# EAGLE design NodecLCD.v1 (EAGLE 4.16)
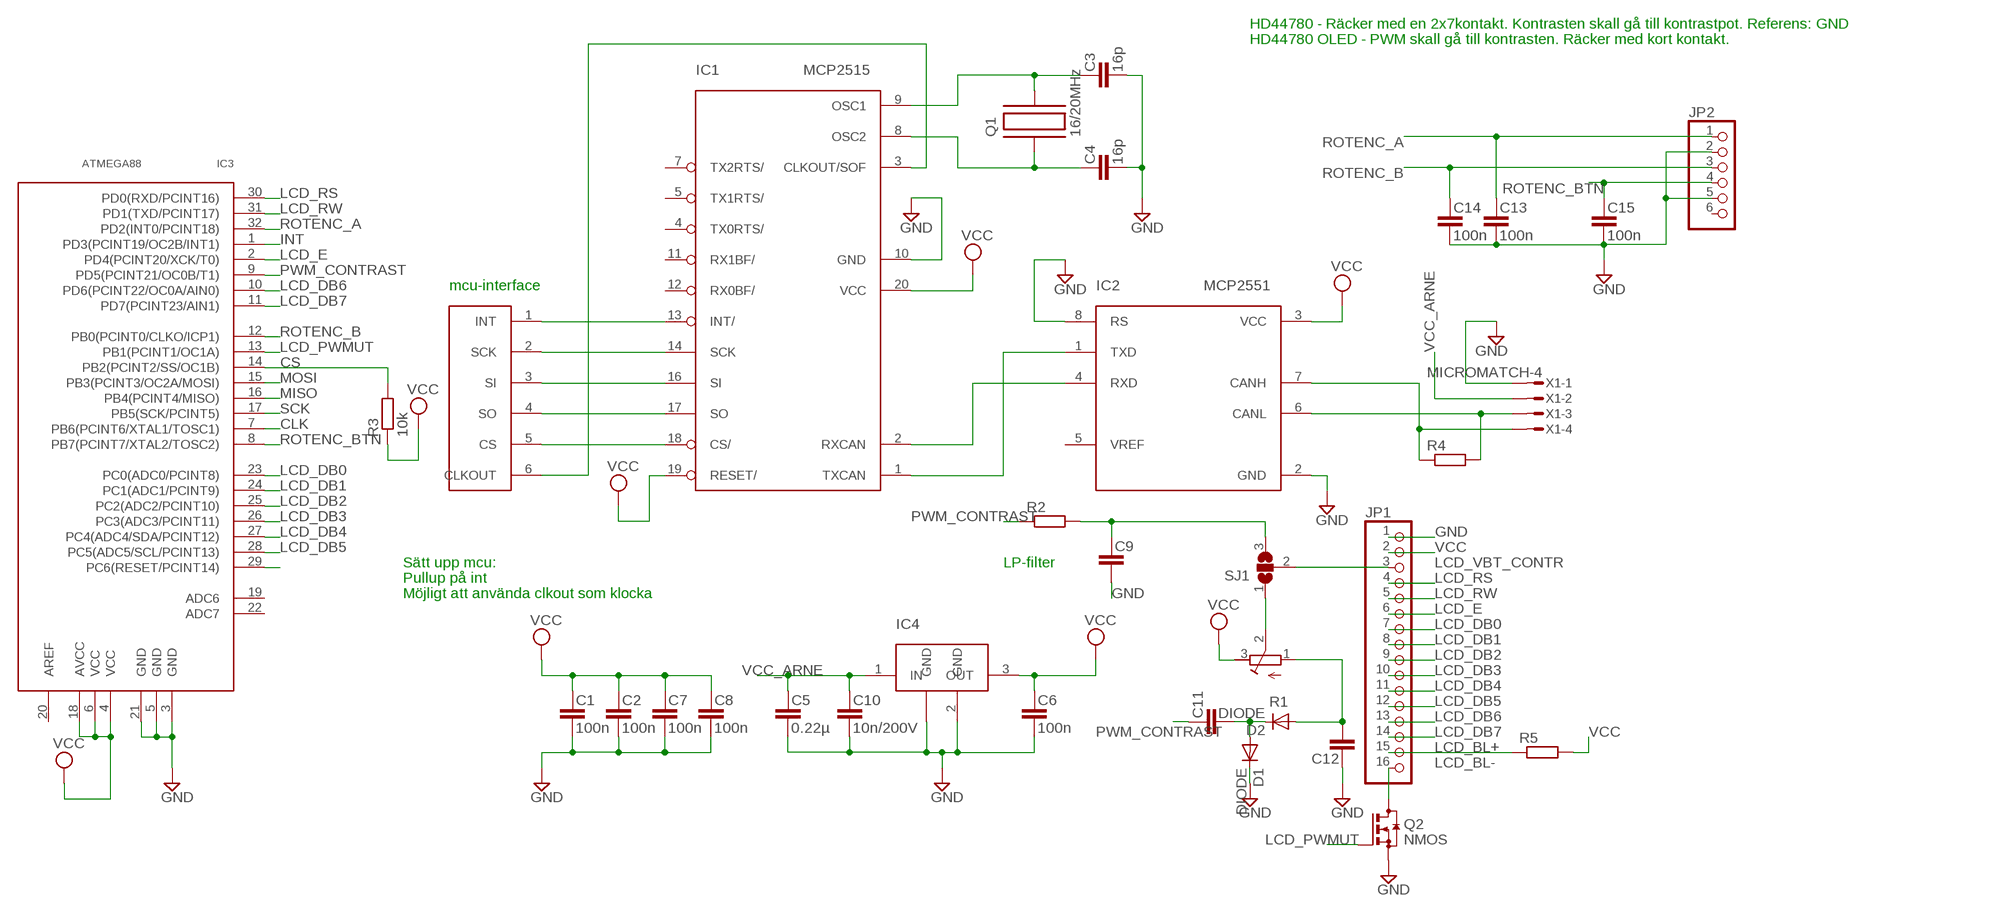
[diagram p0: schematic, sheet 1]

## Parts
C1  100n  C-EU  [C0603]
C2  100n  C-EU  [C0603]
C3  16p  C-EU  [C0603]
C4  16p  C-EU  [C0603]
C5  0.22µ  C-EU  [C0603]
C6  100n  C-EU  [C0603]
C7  100n  C-EU  [C0603]
C8  100n  C-EU  [C0603]
C9  C-EU  [C0603]
C10  10n/200V  C-EU  [C0603]
C11  C-EU  [C0603]
C12  C-EU  [C0603]
C13  100n  C-EU  [C0603]
C14  100n  C-EU  [C0603]
C15  100n  C-EU  [C0603]
D1  DIODE  [SOD323]
D2  DIODE  [SOD323]
IC1  MCP2515  [TSSOP]
IC2  MCP2551  [SOIC]
IC3  ATMEGA88  [TQFP32]
IC4  LM340MP-5.0  [SOT223]
JP1  PINHD-2X08  [2X08]
JP2  PINHD-2X03  [2X03]
Q1  16/20MHz  C-MAC-LFA147E  [SMD]
Q2  NMOS  [SOT23]
R1  R-TRIM  [TRIM_PVZ3]
R2  R-EUR0603  [R0603]
R3  10k  R-EUR0603  [R0603]
R4  R-EUR0603  [R0603]
R5  R-EUR0603  [R0603]
SJ1  SJ_2_NOS  [SJ_2_NO_SMALL]
U$1  CAN-INTERFACE  [VIA-LIST]
X1  MICROMATCH-4  [MICROMATCH-4]

## Nets
CANH: IC2.7(CANH) R4.1 X1.4
CANL: IC2.6(CANL) R4.2 X1.3
CLK: IC1.3(CLKOUT/SOF) IC3.7(PB6(PCINT6/XTAL1/TOSC1)) U$1.6(CLKOUT)
CS: IC1.18(CS/) IC3.14(PB2(PCINT2/SS/OC1B)) R3.2 U$1.5(CS)
GND: C1.2 C2.2 C3.2 C4.2 C5.2 C6.2 C7.2 C8.2 C9.2 C10.2 C12.1 C13.2 C14.2 C15.2 D1.C IC1.10(GND) IC2.2(GND) IC2.8(RS) IC3.3(GND) IC3.5(GND) IC3.21(GND) IC4.2(GND) IC4.4(GND) JP1.1 JP2.2 JP2.5 Q2.2(S) X1.1
INT: IC1.13(INT/) IC3.1(PD3(PCINT19/OC2B/INT1)) U$1.1(INT)
LCD_BL+: JP1.15 R5.1
LCD_BL-: JP1.16 Q2.3(D)
LCD_DB0: IC3.23(PC0(ADC0/PCINT8)) JP1.7
LCD_DB1: IC3.24(PC1(ADC1/PCINT9)) JP1.8
LCD_DB2: IC3.25(PC2(ADC2/PCINT10)) JP1.9
LCD_DB3: IC3.26(PC3(ADC3/PCINT11)) JP1.10
LCD_DB4: IC3.27(PC4(ADC4/SDA/PCINT12)) JP1.11
LCD_DB5: IC3.28(PC5(ADC5/SCL/PCINT13)) JP1.12
LCD_DB6: IC3.10(PD6(PCINT22/OC0A/AIN0)) JP1.13
LCD_DB7: IC3.11(PD7(PCINT23/AIN1)) JP1.14
LCD_E: IC3.2(PD4(PCINT20/XCK/T0)) JP1.6
LCD_PWMUT: IC3.13(PB1(PCINT1/OC1A)) Q2.1(G)
LCD_RS: IC3.30(PD0(RXD/PCINT16)) JP1.4
LCD_RW: IC3.31(PD1(TXD/PCINT17)) JP1.5
LCD_VBT_CONTR: JP1.3 SJ1.2
MISO: IC1.17(SO) IC3.16(PB4(PCINT4/MISO)) U$1.4(SO)
MOSI: IC1.16(SI) IC3.15(PB3(PCINT3/OC2A/MOSI)) U$1.3(SI)
N$1: IC1.2(RXCAN) IC2.4(RXD)
N$2: IC1.1(TXCAN) IC2.1(TXD)
N$3: R1.2(PAD2) SJ1.1
N$4: C11.2 D1.A D2.C
N$5: C12.2 D2.A R1.1(PAD1)
N$6: C9.1 R2.2 SJ1.3
N$12: C3.1 IC1.9(OSC1) Q1.P$2
N$13: C4.1 IC1.8(OSC2) Q1.P$1
PWM_CONTRAST: C11.1 IC3.9(PD5(PCINT21/OC0B/T1)) R2.1
RESET: IC3.29(PC6(RESET/PCINT14))
ROTENC_A: C13.1 IC3.32(PD2(INT0/PCINT18)) JP2.1
ROTENC_B: C14.1 IC3.12(PB0(PCINT0/CLKO/ICP1)) JP2.3
ROTENC_BTN: C15.1 IC3.8(PB7(PCINT7/XTAL2/TOSC2)) JP2.4
SCK: IC1.14(SCK) IC3.17(PB5(SCK/PCINT5)) U$1.2(SCK)
VCC: C1.1 C2.1 C6.1 C7.1 C8.1 IC1.19(RESET/) IC1.20(VCC) IC2.3(VCC) IC3.4(VCC) IC3.6(VCC) IC3.18(AVCC) IC4.3(OUT) JP1.2 R1.3(PAD3) R3.1 R5.2
VCC_ARNE: C5.1 C10.1 IC4.1(IN) X1.2
Unconnected: IC1.4(TX0RTS/) IC1.5(TX1RTS/) IC1.7(TX2RTS/) IC1.11(RX1BF/) IC1.12(RX0BF/) IC2.5(VREF) IC3.19(ADC6) IC3.20(AREF) IC3.22(ADC7) JP2.6

## Notes on the sheet
- HD44780 - Räcker med en 2x7kontakt. Kontrasten skall gå till kontrastpot. Referens: GND
- HD44780 OLED - PWM skall gå till kontrasten. Räcker med kort kontakt.
- mcu-interface
- Sätt upp mcu: | LP-filter
- Pullup på int
- Möjligt att använda clkout som klocka

## Library data of the parts
C1-C15 = rcl:C-EU
D1 D2 = diode:DIODE: DIODE ultra fast rectifier, 3 A
IC1 = mcp2515:MCP2515
IC2 = mcp2551:MCP2551
IC3 = atmega88:ATMEGA88
IC4 = lm340mp:LM340MP-5.0
JP1 = pinhead-mm:PINHD-2X08
JP2 = pinhead-mm:PINHD-2X03
Q1 = hc49-4h-smx:C-MAC-LFA147E
Q2 = transistor:NMOS
R1 = rcl:R-TRIM
R2-R5 = rcl:R-EU
SJ1 = jumper:SJ_2_NO
U$1 = can-interface:CAN-INTERFACE
X1 = con-amp-micromatch:MICROMATCH-4: MicroMaTch 4 7-215464-4 / 0-215464-4 Drawing Number C-215464 DDEController.pdf

## Board
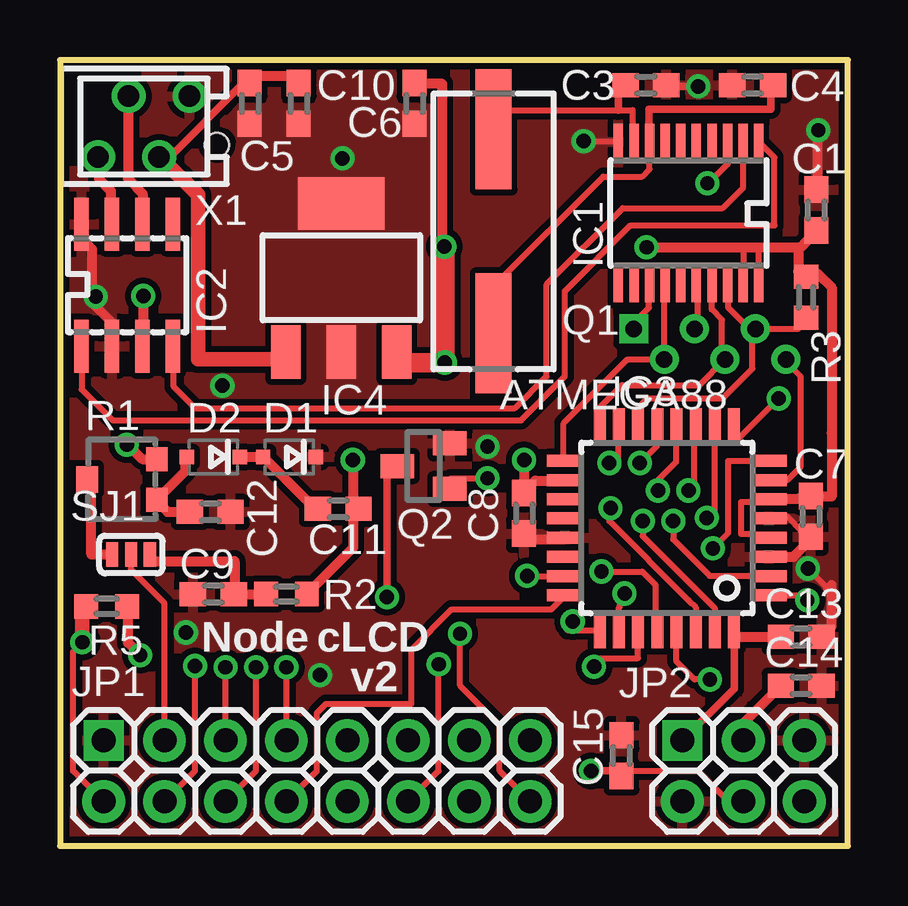
[diagram p1: board, top side]
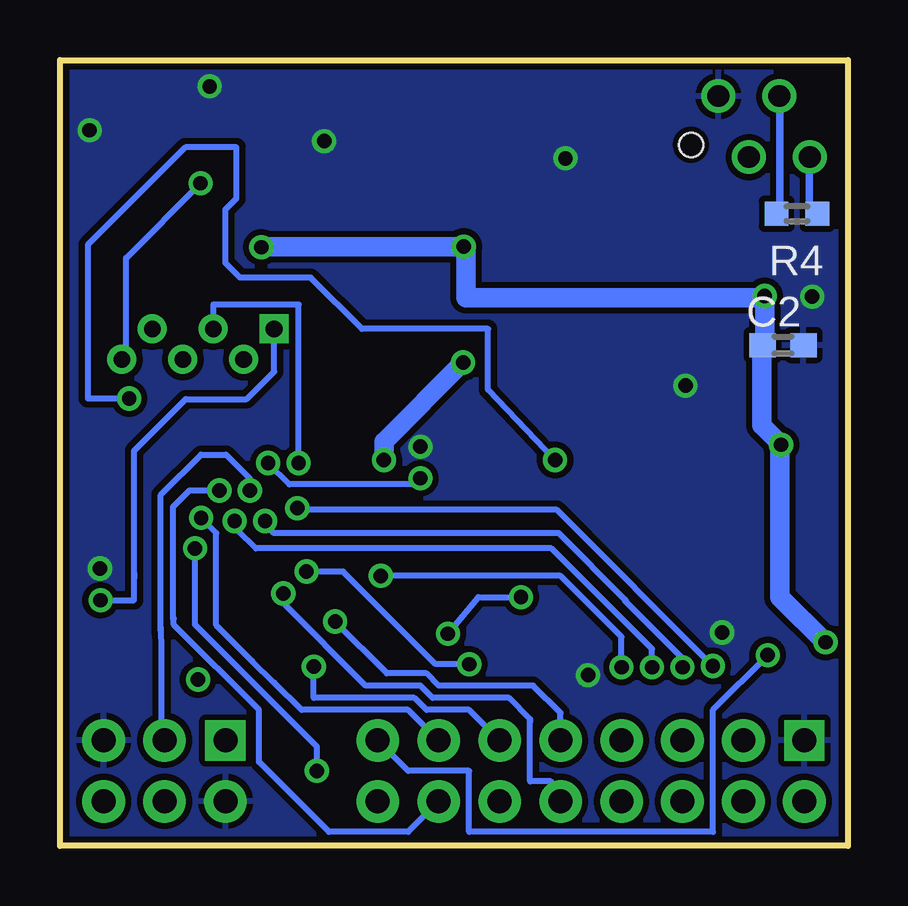
[diagram p2: board, bottom side, seen from below]

Size 32.85 x 32.75 mm. Coordinates in mm from the lower left corner, seen from the top.
Outline: 0,0 32.85,0 32.85,32.75 0,32.75 0,0
Copper layers (1*16): Top 0.035mm / dielectric 1.5mm / Bottom 0.035mm
Design rules "10mils, 0.6drill": minimum track width 10mil, minimum drill 0.6mm, track to track 10mil, track to pad 10mil, pad to pad 10mil, via to via 10mil, smd to smd 10mil, copper to edge 10mil, drill to drill 10mil, minimum pad ring 10mil, minimum via ring 8mil, stop-mask expansion 0mil, vias tented up to drill 0mil, thermal gap 10mil

### Footprints (pad centres in the part's own frame; a part is rotated, then mirrored left to right if it is on the bottom)
C0603 = smd 1.1 x 1: 1 -0.85,0; 2 0.85,0
SOD323 = smd 0.6 x 0.6: A 1.1,0; C -1.1,0
TSSOP = smd 0.396 x 1.5: 1 -2.925,-2.975; 2 -2.275,-2.975; 3 -1.625,-2.975; 4 -0.975,-2.975; 5 -0.325,-2.975; 6 0.325,-2.975; 7 0.975,-2.975; 8 1.625,-2.975; 9 2.275,-2.975; 10 2.925,-2.975; 11 2.925,2.975; 12 2.275,2.975; 13 1.625,2.975; 14 0.975,2.975; 15 0.325,2.975; 16 -0.325,2.975; 17 -0.975,2.975; 18 -1.625,2.975; 19 -2.275,2.975; 20 -2.925,2.975
SOIC = smd 0.6 x 2.2: 1 -1.905,-2.54; 2 -0.635,-2.54; 3 0.635,-2.54; 4 1.905,-2.54; 5 1.905,2.54; 6 0.635,2.54; 7 -0.635,2.54; 8 -1.905,2.54
TQFP32 = smd 1.5 x 0.5: 1 -4.25,2.65; 2 -4.25,1.85; 3 -4.25,1.05; 4 -4.25,0.25; 5 -4.25,-0.55; 6 -4.25,-1.35; 7 -4.25,-2.15; 8 -4.25,-2.95; 17 4.25,-2.95; 18 4.25,-2.15; 19 4.25,-1.35; 20 4.25,-0.55; 21 4.25,0.25; 22 4.25,1.05; 23 4.25,1.85; 24 4.25,2.65 | smd 0.5 x 1.5: 9 -2.8,-4.4; 10 -2,-4.4; 11 -1.2,-4.4; 12 -0.4,-4.4; 13 0.4,-4.4; 14 1.2,-4.4; 15 2,-4.4; 16 2.8,-4.4; 25 2.8,4.1; 26 2,4.1; 27 1.2,4.1; 28 0.4,4.1; 29 -0.4,4.1; 30 -1.2,4.1; 31 -2,4.1; 32 -2.8,4.1
SOT223 = smd 1.219 x 2.235: 1 -2.311,-3.099; 2 0,-3.099; 3 2.311,-3.099 | smd 3.6 x 2.2: 4 0,3.099
2X08 = drill 1 pad 1.676 square: 1 -8.89,1.27 | drill 1 pad 1.778 round: 2 -8.89,-1.27; 3 -6.35,1.27; 4 -6.35,-1.27; 5 -3.81,1.27; 6 -3.81,-1.27; 7 -1.27,1.27; 8 -1.27,-1.27; 9 1.27,1.27; 10 1.27,-1.27; 11 3.81,1.27; 12 3.81,-1.27; 13 6.35,1.27; 14 6.35,-1.27; 15 8.89,1.27; 16 8.89,-1.27
2X03 = drill 1 pad 1.676 square: 1 -2.54,1.27 | drill 1 pad 1.778 round: 2 -2.54,-1.27; 3 0,1.27; 4 0,-1.27; 5 2.54,1.27; 6 2.54,-1.27
SMD = smd 5 x 1.5: P$1 4.25,0; P$2 -4.25,0
SOT23 = smd 1 x 1.4: 1 -0.95,-1.1; 2 0.95,-1.1; 3 0,1.1
TRIM_PVZ3 = smd 1 x 0.9: 1 0.5,0.45; 3 2.2,0.45 | smd 1.1 x 0.9: 2 1.35,3.35
R0603 = smd 0.991 x 1.016: 1 -0.85,0; 2 0.85,0
SJ_2_NO_SMALL = smd 0.508 x 1.016: 1 -0.787,0; 2 0,0; 3 0.787,0
VIA-LIST = drill 0.7 square: 1 0,2.54 | drill 0.7 round: 2 -1.27,1.27; 3 0,0; 4 -1.27,-1.27; 5 0,-2.54; 6 -1.27,-3.81
MICROMATCH-4 = drill 0.9 round: 1 1.905,1.27; 2 0.635,-1.27; 3 -0.635,1.27; 4 -1.905,-1.27 | hole 1: 3.048,-0.762

### Placement (x,y rotation side)
C1  31.54,26.49 90 top
C2  2.7,20.86 0 bottom
C3  24.43,31.7 0 top
C4  28.87,31.7 180 top
C5  7.92,30.94 270 top
C6  14.77,30.94 270 top
C7  31.3,13.73 270 top
C8  19.34,13.86 270 top
C9  6.39,10.49 180 top
C10  9.95,30.94 270 top
C11  11.6,14.05 180 top
C12  6.26,13.92 180 top
C13  30.9,8.71 0 top
C14  30.9,6.68 0 top
C15  23.41,3.76 90 top
D1  9.57,16.21 180 top
D2  6.39,16.21 180 top
IC1  26.21,26.37 180 top
IC2  2.8,23.36 0 top
IC3  25.3,13.09 180 top
IC4  11.73,23.67 0 top
JP1  10.71,3.12 0 top
JP2  28.49,3.12 0 top
Q1  18.08,25.6 270 top
Q2  15.15,15.82 90 top
R1  4.49,13.92 90 top
R2  9.44,10.49 180 top
R3  31.11,22.86 270 top
R4  2.12,26.34 180 bottom
R5  1.95,9.98 180 top
SJ1  2.96,12.14 0 top
U$1  26.46,21.54 90 top
X1  3.5,29.97 0 top

### Tracks (layer width: path | path; a pad name or v marks a point on that pad's centre or on a via)
CANH
  Top 0.305: 2.12,25.95 IC2.7 | X1.4 1.62,28.7
  Top 0.406: 2.12,25.95 2.12,27.28 1.62,27.79 1.62,28.7
  Bottom 0.305: X1.4 1.62,28.7 1.62,26.68 R4.1
CANL
  Top 0.305: IC2.6 | X1.3 2.84,31.24
  Top 0.406: IC2.6 3.45,27.18 2.84,27.79 2.84,31.24
  Bottom 0.305: X1.3 2.84,31.24 2.84,26.48 R4.2
CLK  (via drill 0.6)
  Top 0.254: IC1.3 27.83,29.24 27.83,28.4 27.02,27.59 v26.99,27.61 | IC3.7 30.32,15.24 30.88,15.8 30.88,19.56 30.22,20.22 30.17,20.27
  Top 0.406: 30.17,20.17 30.22,20.22 U$1.6
  Bottom 0.254: v26.99,27.61 30.09,24.49 30.09,20.42 U$1.6
CS
  Top 0.254: IC1.18 27.83,23.52 27.86,23.52 27.86,22.43 28.87,21.41 | IC3.14 24.07,17.63 | 24.07,17.63 24.07,17.64 | 28.87,21.41 28.87,19.89 27.63,18.64 24.48,18.64 24.07,18.24 24.07,17.83 24.17,17.12 24.07,17.63 | 28.87,21.41 U$1.5 30.78,21.54 31.03,21.79 31.03,22 30.97,22 R3.2
GND  (via drill 0.6)
  Top 0.254: v21.84,29.36 23.28,29.36 IC1.10 | C1.2 31.59,27.66 | 1.34,22.63 v1.49,22.89 | C7.2 31.11,13.08 30.93,13.08 30.32,13.72 29.76,13.67 29.74,13.64 IC3.5 | v31.61,29.82 31.44,29.77 31.59,29.62 | Q2.2 16.63,16.79 | v31.18,11.56 32.02,10.72 32.3,10.44
  Top 0.305: IC2.2 2.2,21.16 | C3.2 25.45,31.65 v26.61,31.65 | 30.93,13.08 31.16,13.08 31.18,13.06 31.18,12.55
  Top 0.406: 2.2,21.16 2.2,21.77 1.34,22.63 1.34,24.87 0.83,25.38 IC2.8 | 31.59,27.66 31.59,29.62 | 31.18,12.55 31.08,12.55 30.58,12.04 IC3.3 | IC3.21 21,12.79 21,12.78 19.7,12.78 C8.2 | 32.02,10.72 32.17,10.87 32.17,9.13 C13.2
  Bottom 0.305: v26.61,31.65 26.56,31.73
  other vias: 11.78,28.65 17.82,16.64 6.77,19.18 10.84,7.11 5.25,8.89
  pour Bottom (isolate 0.254): 0.12,32.64 32.83,32.64 32.83,0.23 24.38,0.22 0.12,0.22
  pour Top (isolate 0.305, no thermals): 5.83,32.27 15.89,32.27 15.89,18.56 5.83,18.56
  pour Top (isolate 0.254): 0.17,32.59 32.68,32.59 32.68,0.2 0.17,0.2
INT  (via drill 0.6)
  Top 0.254: IC1.13 | IC1.13 | U$1.1 23.92,21.79 24.55,22.43 24.55,23.37 IC1.13 | IC3.1 31.16,10.44 v31.16,10.24
  Bottom 0.254: 29.76,11.38 29.76,16.46 27.6,18.62 25.06,18.62 23.92,19.76 U$1.1 | 29.76,11.38 29.76,11.13 | v31.16,10.24 29.76,10.24 29.76,11.38
LCD_BL+  (via drill 0.6)
  Top 0.254: 2.84,9.98 3.09,9.98
  Top 0.406: R5.1 2.84,9.98 2.84,8.46 v3.34,7.95
  Bottom 0.254: JP1.15 18.33,3.12 15.79,3.12 15.79,0.59 5.63,0.59 5.63,5.66 v3.34,7.95
LCD_BL-  (via drill 0.6)
  Top 0.254: JP1.16 18.33,3.12 18.33,5.03 16.68,6.68 v16.68,8.84
  Top 0.305: Q2.3 13.63,15.82 v13.63,10.36
  Bottom 0.254: v16.68,8.84 15.41,10.36 v13.63,10.36
  Bottom 0.305: v13.63,10.36 13.63,10.49
LCD_DB0  (via drill 0.6)
  Top 0.254: JP1.7 v9.44,7.44 | IC3.23 19.48,11.24 v19.47,11.25
  Bottom 0.254: v9.44,7.44 9.44,8.71 11.98,11.25 v19.47,11.25
LCD_DB1
  Top 0.254: 20.49,9.86 21,10.39 IC3.24 21.05,10.42 20.49,9.86 | 20.49,9.86 16.32,9.86 14.65,8.18 14.65,5.92 11.09,5.92 10.71,5.54 10.71,3.12 JP1.8
LCD_DB2  (via drill 0.6)
  Top 0.254: IC3.25 21.15,8.99 v21.38,9.35
  Bottom 0.254: v21.38,9.35 19.22,7.19 17.57,7.19 17.06,6.68 13.12,6.68 11.98,5.54 JP1.9
LCD_DB3  (via drill 0.6)
  Top 0.254: IC3.26 23.28,9.01 23.28,9.88 v23.54,10.52
  Bottom 0.254: 13.25,5.16 13.25,2.69 12.39,2.69 JP1.10 | 13.25,5.16 13.25,5.23 | v23.54,10.52 23.54,10.11 20.11,6.68 17.82,6.68 17.31,6.17 14.14,6.17 13.25,5.28 13.25,5.16
LCD_DB4  (via drill 0.6)
  Top 0.254: v22.27,7.47 22.27,7.82 24.1,7.82 IC3.27
  Bottom 0.254: v22.27,7.47 22.27,6.17 18.08,6.17 17.57,5.66 15.79,5.66 JP1.11
LCD_DB5  (via drill 0.6)
  Top 0.254: v22.57,11.43 24.27,11.43 24.83,10.87 24.83,9.7 IC3.28 | JP1.12 15.79,3.12 v15.79,7.57
  Bottom 0.254: v15.79,7.57 17.19,7.57 21.05,11.43 v22.57,11.43
LCD_DB6  (via drill 0.6)
  Top 0.254: IC3.10 27.3,14 v26.97,13.67
  Bottom 0.254: v26.97,13.67 26.34,13.02 26.33,13.03 | JP1.13 18.33,5.66 22.77,5.66 23.92,6.81 24.83,7.7 26.33,9.2 26.33,13.03 | 26.33,13.03
LCD_DB7  (via drill 0.6)
  Top 0.254: v26.2,14.81 26.46,14.81 26.46,17.45 IC3.11
  Bottom 0.254: v26.2,14.81 27.45,14.81 28.13,14.12 28.13,9.48 28.11,9.48 28.11,9.22 24.55,5.66 24.55,3.51 21.63,0.59 18.33,0.59 JP1.14
LCD_E  (via drill 0.6)
  Top 0.254: JP1.6 8.17,3.12 v8.17,7.44 | IC3.2 27.09,11.25 25.57,12.78 v25.57,13.54
  Bottom 0.254: v8.17,7.44 8.17,8.2 12.36,12.4 24.68,12.4 25.44,13.16 v25.57,13.54
LCD_PWMUT  (via drill 0.6)
  Top 0.254: IC3.13 24.9,16.68 v24.17,15.95 | 16.3,14.88 16.3,14.81 | 16.3,14.88 Q2.1 16.24,14.88 | v17.82,15.32 16.3,15.32 16.3,14.88
  Bottom 0.254: v24.17,15.95 23.28,15.06 17.82,15.06 v17.82,15.32
LCD_RS  (via drill 0.6)
  Top 0.254: 22.95,13.67 v22.95,14.07 22.93,14.05 22.9,14.05 22.9,13.54 26.2,10.24 | 5.71,7.32 v5.63,7.49 5.63,7.32 | JP1.4 5.63,3.12 5.63,7.32 | 5.63,7.32 5.63,7.44 | 26.2,10.24 26.33,10.11 | IC3.30 26.5,9.94 26.2,10.24
  Bottom 0.254: v22.95,14.07 22.77,14 12.13,14 v5.63,7.49
LCD_RW  (via drill 0.6)
  Top 0.254: JP1.5 v6.9,7.44 | v24.3,13.54 24.3,12.9 27.3,9.9 IC3.31
  Bottom 0.254: v24.3,13.54 23.94,13.03 12.06,13.03 9.29,10.26 | 9.29,10.26 9.24,10.21 | 9.29,10.26 9.31,10.24 6.9,7.82 v6.9,7.44
LCD_VBT_CONTR
  Top 0.254: JP1.3 4.36,10.11 2.96,11.51 SJ1.2
MISO
  Top 0.254: IC1.17 27.18,23.46 27.17,23.45 27.17,22.35 27.6,21.92 27.6,20.52 27.73,20.4 U$1.4 26.66,19.2 23.43,19.2 22.45,18.21 22.45,17.02 22.44,17.01 22.41,17.01 | IC3.16 22.41,17.01 | 22.41,17.01 22.39,17.08
MOSI  (via drill 0.6)
  Top 0.254: 26.51,23.5 26.53,23.52 IC1.16 26.56,23.37 26.51,23.27 26.58,23.19 26.58,21.67 U$1.3 | IC3.15 23.28,17.49 23.28,15.95 v22.9,15.95
  Bottom 0.254: 26.51,21.59 U$1.3 26.46,22.56 22.9,22.56 v22.9,15.95
N$1
  Top 0.254: 4.77,20.78 4.75,20.78 IC2.4 4.71,20.81 4.74,20.78 4.74,19.13 5.63,18.24 18.96,18.24 20.29,19.56 20.29,23.39 23.46,26.57 27.63,26.57 28.48,27.42 IC1.2
N$2
  Top 0.254: IC1.1 29.79,28.69 29.79,25.86 23.79,25.86 21.05,23.11 21.05,19.56 19.22,17.73 2.2,17.73 0.91,19.02 IC2.1 | IC2.1 0.91,20.88 | IC2.1
N$3
  Top 0.406: SJ1.1 1.31,12.14 1.31,15.27 R1.2
N$4
  Top 0.406: D2.C D1.A 10.63,14.05 C11.2
N$5
  Top 0.406: 3.99,14.42 3.98,14.43 | 3.99,14.42 R1.1 5.25,15.63 5.25,16.21 D2.A | C12.2 4.49,13.92 3.99,14.42
N$6
  Top 0.305: SJ1.3 3.75,11.86
  Top 0.406: 7.28,10.49 R2.2 | 7.28,10.49 C9.1 | 3.75,11.86 7.28,11.86 7.28,10.49
N$12
  Top 0.254: IC1.9 23.87,29.69 23.87,30.66 23.28,30.66 18.13,30.66 Q1.P$2
  Top 0.305: C3.1 23.28,31.23 23.28,30.66
N$13
  Top 0.254: Q1.P$1 18.14,23.39 22.65,27.89 24.27,27.89 24.58,28.2 24.58,29.11 24.55,29.13 24.55,29.22
  Top 0.305: IC1.8 24.55,29.22 24.55,30.68 29.63,30.68 29.63,31.74 C4.1
PWM_CONTRAST  (via drill 0.6)
  Top 0.254: v29.96,18.64 28.34,17.02 IC3.9
  Top 0.406: v12.21,16.08 12.23,16.08 12.23,14.26 C11.1 12.32,14.17 12.23,14.17 12.23,12.43 R2.1
  Bottom 0.254: v12.21,16.08 15,19 15,21.54 20.26,21.54 22.39,23.67 25.34,23.67 25.95,24.28 25.95,26.52 25.49,26.98 25.49,29.11 27.63,29.11 31.69,25.04 31.69,18.64 v29.96,18.64
RESET  (via drill 0.6)
  Top 0.254: 25.7,9.09 IC3.29 25.7,7.7 26.46,6.93 v27.09,6.93
ROTENC_A
  Top 0.254: IC3.32 28.1,8.98 28.11,8.97 28.11,8.71
  Top 0.305: 28.11,8.71 28.11,6.55 JP2.1
  Top 0.406: IC3.32 | 28.11,8.71 C13.1
ROTENC_B  (via drill 0.6)
  Top 0.254: v24.93,14.81 24.91,15.21 25.7,16 IC3.12
  Top 0.406: C14.1 28.49,5.12 JP2.3
  Bottom 0.254: 28.64,9.09 28.64,8.89 | 28.64,9.09 28.64,14.63 26.97,16.31 25.93,16.31 24.93,15.32 v24.93,14.81 24.81,14.68 | 28.64,9.09 28.62,8.46 28.62,4.52 JP2.3
ROTENC_BTN  (via drill 0.6)
  Top 0.254: IC3.8 27.86,16.04 27.86,13.03 v27.22,12.4 | JP2.4 27.86,1.85 26.58,3.12 23.54,3.12 23.41,3.12
  Top 0.305: v22.14,3.12 23.54,3.12 C15.1 23.41,3.12
  Top 0.406: C15.1 23.37,2.87
  Bottom 0.254: v22.14,3.12 22.14,4.14 27.22,9.22 v27.22,12.4
SCK
  Top 0.254: 25.23,23.49 25.19,23.45 IC1.14 25.19,23.39 | IC3.17 21,15.98 21,17.6 23.66,20.27 U$1.2 25.19,23.39 | IC1.14 25.24,23.42 25.19,23.39
VCC  (via drill 0.6)
  Top 0.254: 29.81,14.45 IC3.6 | IC3.6 29.05,14.45 | IC1.20 29.12,23.52 29.12,24.94 29.68,24.94 | IC1.19 28.48,23.45 28.49,23.45 28.49,24.94 28.49,24.97 | 30.57,24.99 30.78,24.99 30.9,24.97 | 19.27,14.63 C8.1 19.35,14.84 | v2.79,16.71 2.79,16.61 | IC3.4 28.85,13.01 28.39,13.01 28.39,14.33 28.85,14.33 IC3.6 | 16.04,19.91 16.04,19.96 16.02,20 15.95,20.13 | 3.73,16.08 3.77,16.12 R1.3 | JP1.2 0.55,3.12 0.55,8.08 0.93,8.46 v0.93,8.48
  Top 0.406: 14.08,20.13 14.08,20.83 IC4.3 | IC2.3 3.42,21.21 3.47,21.69 v3.47,22.91 | v16.02,24.97 15.95,24.84 15.95,31.75 14.83,31.75 14.77,31.7 C6.1 | v24.45,24.94 28.49,24.94 29.68,24.94 | 29.68,24.94 | IC3.18 20.56,15.21 19.8,15.21 C8.1 | 29.81,14.45 30.7,14.45 C7.1 31.41,14.55 32.17,14.55 32.17,17.2 32.17,23.27 31.61,23.83 30.88,23.83 | 29.68,24.94 30.78,24.94 | 30.78,24.94 30.9,24.94 30.9,24.97 C1.1 | 30.88,23.83 30.88,23.74 R3.1 | 30.88,23.83 30.78,23.93 30.78,24.94 | 19.27,14.63 19.35,14.63 v19.35,16.08 | 16.02,20 16.03,20 16.04,20.02 v16.04,20.14 | v2.79,16.71 2.84,16.71 3.43,16.12 3.77,16.12
  Top 0.61: R5.2 1.06,9.98 0.93,9.86 v0.93,8.48
  Top 0.813: IC4.3 14.14,20.57 14.14,20.13 15.95,20.13 16.04,20.13 16.04,24.97 v16.02,24.97
  Bottom 0.254: 3.47,21.36 C2.1 3.7,20.37
  Bottom 0.406: 3.47,22.84 v3.47,22.91 | 24.3,24.84 24.4,24.94 v24.45,24.94 | C2.1 3.73,20.69 | 2.84,16.71 v2.79,16.71
  Bottom 0.813: v16.04,20.14 19.35,16.84 v19.35,16.08 | v2.79,16.71 3.6,17.53 3.6,20.91 3.59,20.91 C2.1 3.51,20.91 3.47,20.91 3.47,22.84 15.92,22.84 15.92,24.84 v16.02,24.97 24.43,24.97 24.43,24.94 v24.45,24.94 | v0.93,8.48 0.93,8.46 2.84,10.36 2.84,16.71
VCC_ARNE
  Top 0.254: 7.88,31.75 C5.1
  Top 0.305: 9.31,20.7 IC4.1 | 7.88,31.75 7.61,31.75 4.56,28.7 4.26,28.7 | X1.2 4.26,28.7 | 4.26,28.7 4.67,28.7
  Top 0.406: C10.1 9.95,32.08 7.92,32.08 C5.1
  Top 0.61: 9.31,20.7 8.88,20.27 5.76,20.27 5.76,27.13 4.18,28.7 X1.2

### Text on the board
tPlace: Node | cLCD | v2